# EasyEDA schematic 1-Schematic_WIFI_WAVER.json
TITLE: Sheet_1; REV: 1.0; Date: 2022-12-29; Sheet: 1/1; Drawn By: maarnotto; Company: Your Company
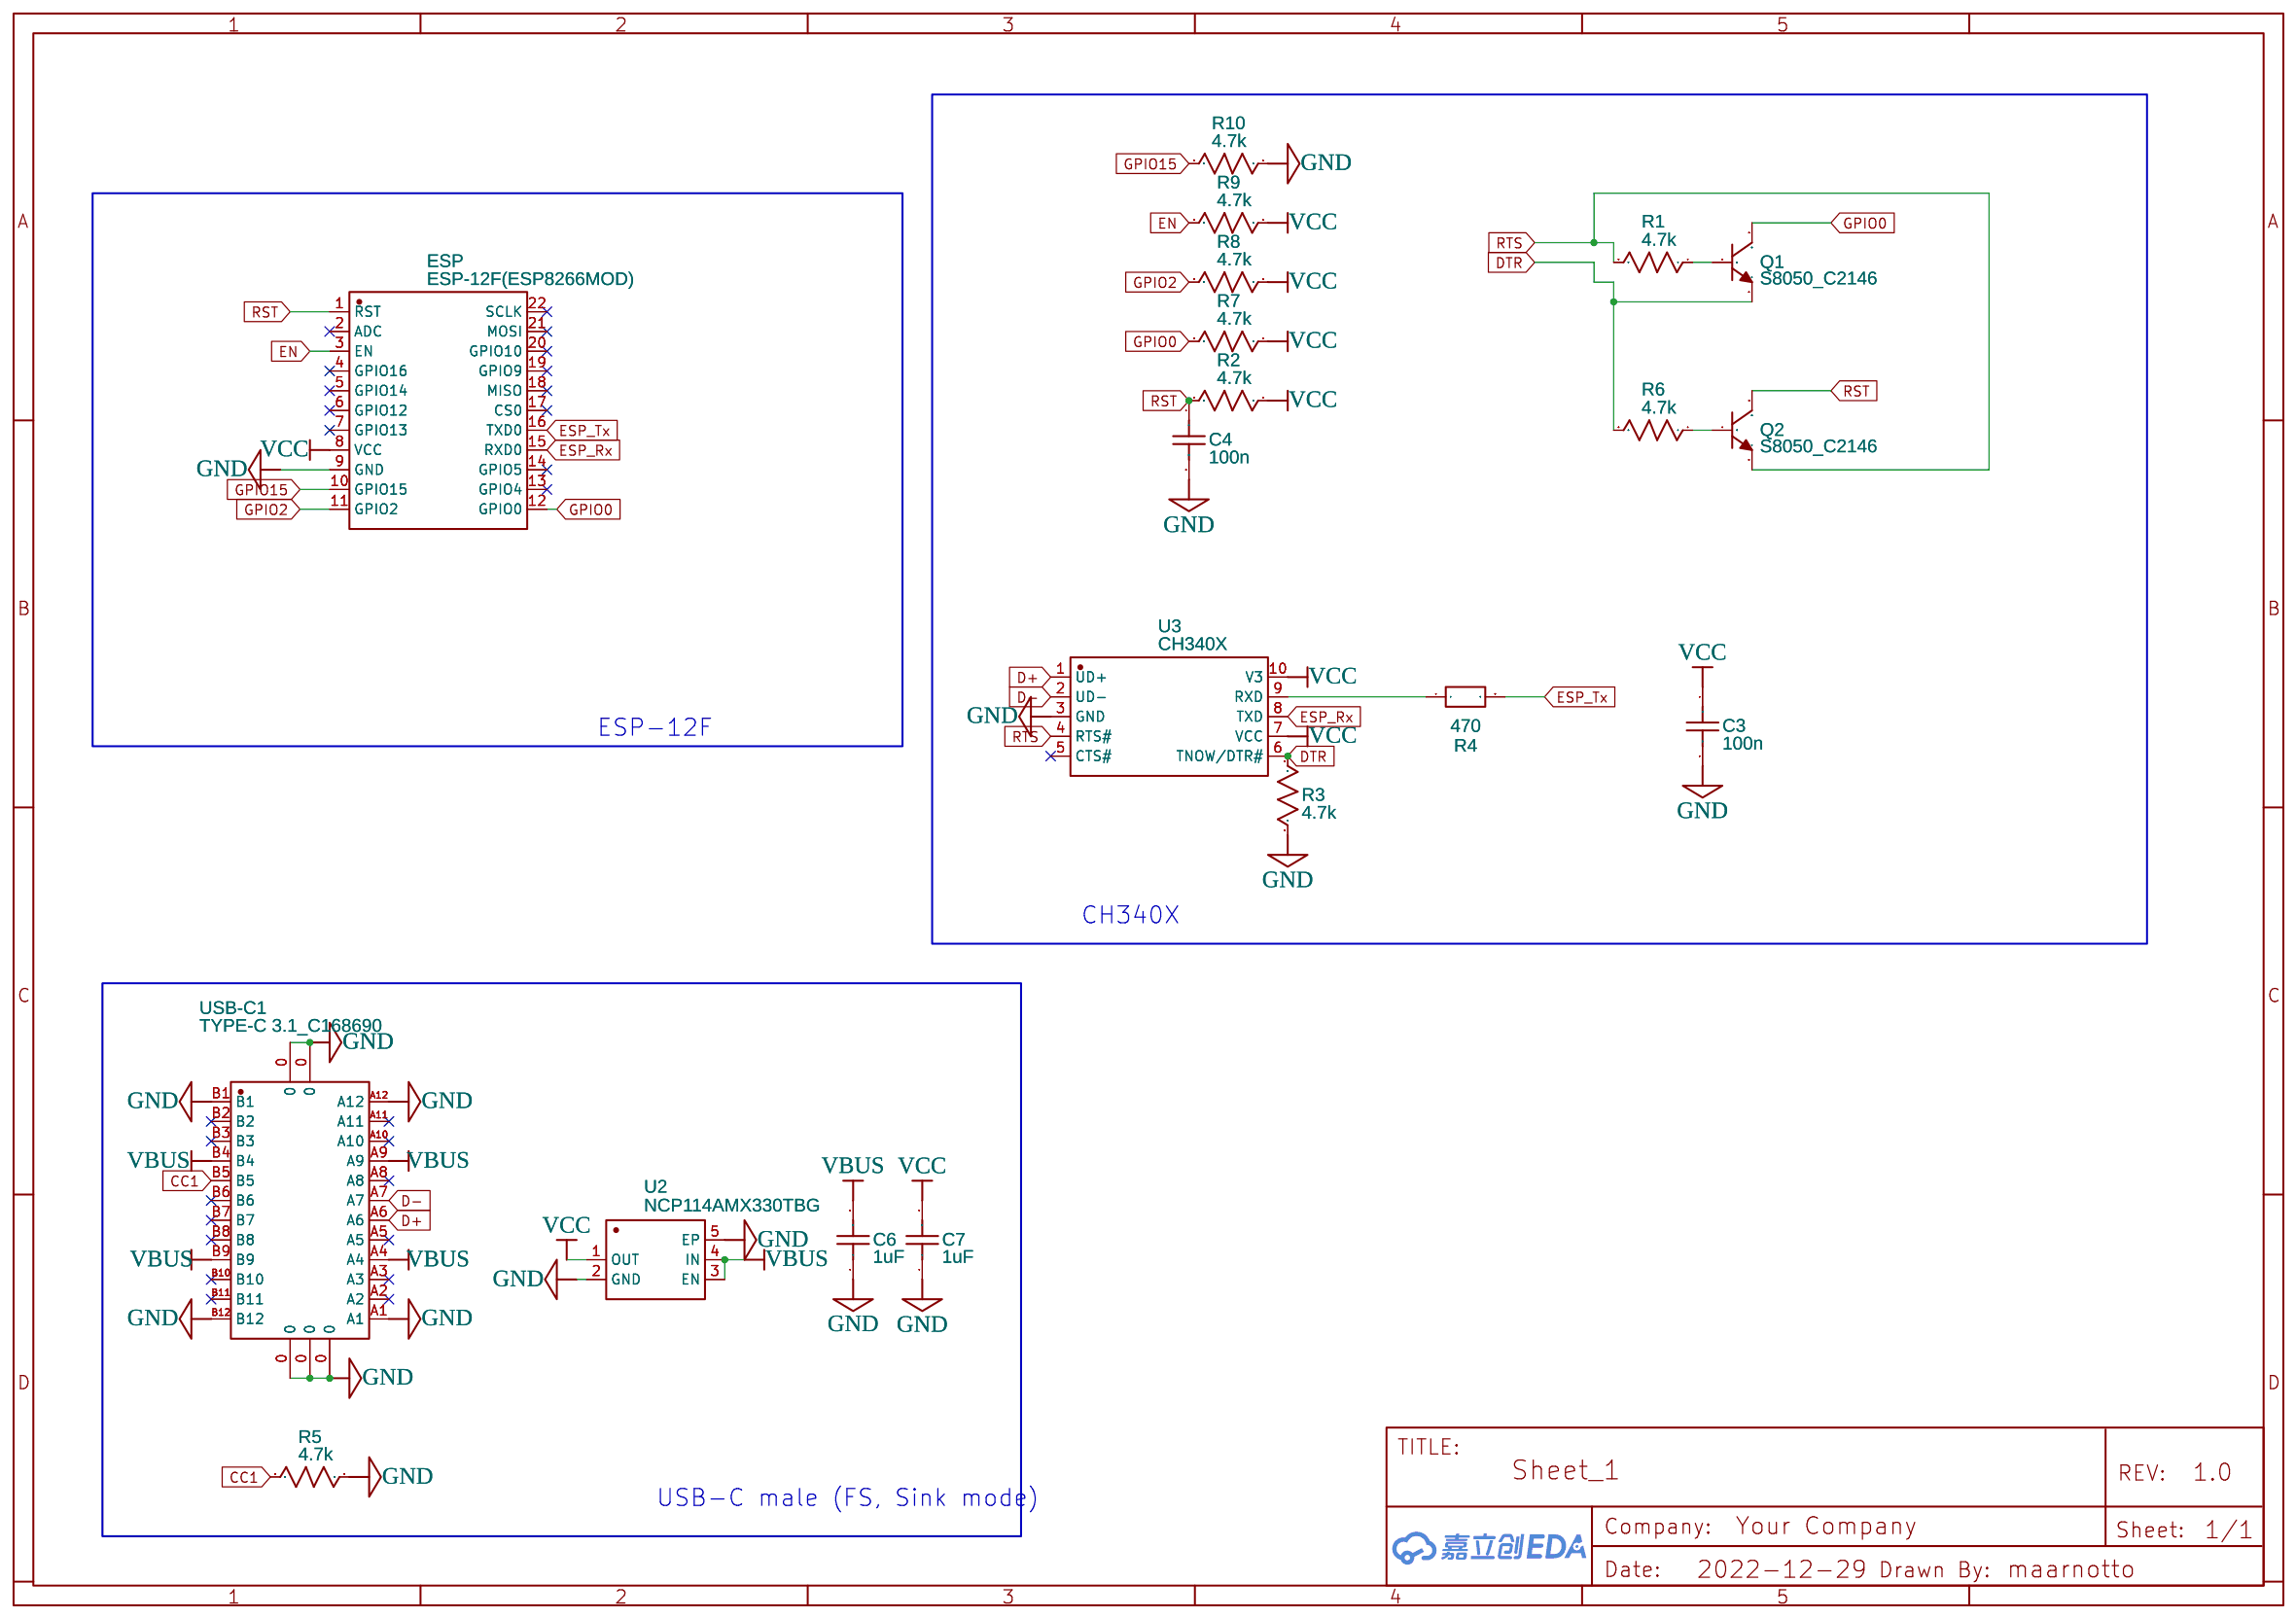
[diagram p0: schematic sheet]

## Parts
C3  100n  [C0402]
C4  100n  [C0402]
C6  1uF  [C0402]
C7  1uF  [C0402]
ESP  ESP-12F(ESP8266MOD)  [WIFIM-SMD_ESP-12F-ESP8266MOD]
Q1  S8050_C2146  [SOT-23-3_L3.0-W1.7-P0.95-LS2.9-BR]
Q2  S8050_C2146  [SOT-23-3_L3.0-W1.7-P0.95-LS2.9-BR]
R1  4.7k  [R0402]
R2  4.7k  [R0402]
R3  4.7k  [R0402]
R4  470  [R0402]
R5  4.7k  [R0402]
R6  4.7k  [R0402]
R7  4.7k  [R0402]
R8  4.7k  [R0402]
R9  4.7k  [R0402]
R10  4.7k  [R0402]
U2  NCP114AMX330TBG  [UDFN-4_L1.0-W1.0-P0.65-BL-EP]
U3  CH340X  [MSOP-10_L3.0-W3.0-P0.50-LS5.0-BL]
USB-C1  TYPE-C 3.1_C168690  [USB-C-SMD_TYPE-C-USB-3]

## Library data of the parts
C3 C4 C6 C7 = C_0603_US: Contributor: LCEDA_Lib
ESP = ESP-12F(ESP8266MOD): Supplier: LCSC; Manufacturer: Ai-Thinker(安信可); Supplier Part: C82891; JLCPCB Part Class: Extended Part
Q1 Q2 = S8050_C2146: Supplier: LCSC; Manufacturer: CJ(江苏长电/长晶); Manufacturer Part: S8050 J3Y; Supplier Part: C2146; JLCPCB Part Class: Basic Part
R1-R3 R5-R10 = R_0603_US: Contributor: LCEDA_Lib
R4 = R_0603_EU: Contributor: LCEDA_Lib
U2 = NCP114AMX330TBG: Contributor: LCSC; Supplier: LCSC; Supplier Part: C603494; Manufacturer: onsemi(安森美); JLCPCB Part Class: Extended Part
U3 = CH340X: Contributor: lcsc; Supplier: LCSC; Supplier Part: C3035748; Manufacturer: WCH(南京沁恒); JLCPCB Part Class: Extended Part
USB-C1 = TYPE-C 3.1_C168690: Contributor: 立创EDA官方封装库; Supplier: LCSC; Supplier Part: C168690; Manufacturer: 精拓金; Manufacturer Part: 918-118A2021Y40000; JLCPCB Part Class: Extended Part

## Nets
GND: C3.2 C4.2 C6.1 C7.1 ESP.9(GND) R3.1 R5.1 R10.1 U2.2(GND) U2.5(EP) U3.3(GND) USB-C1.0 USB-C1.A1 USB-C1.A12 USB-C1.B1 USB-C1.B12
VBUS: C6.2 U2.3(EN) U2.4(IN) USB-C1.A4 USB-C1.A9 USB-C1.B4 USB-C1.B9
VCC: C3.1 C7.2 ESP.8(VCC) R2.1 R7.1 R8.1 R9.1 U2.1(OUT) U3.7(VCC) U3.10(V3)
CC1: R5.2 USB-C1.B5
D+: U3.1(UD+) USB-C1.A6
D-: U3.2(UD-) USB-C1.A7
DTR: Q1.2(E) R3.2 R6.2 U3.6(TNOW/DTR#)
EN: ESP.3(EN) R9.2
ESP_Rx: ESP.15(RXD0) U3.8(TXD)
ESP_Tx: ESP.16(TXD0) R4.2
GPIO0: ESP.12(GPIO0) Q1.3(C) R7.2
GPIO2: ESP.11(GPIO2) R8.2
GPIO15: ESP.10(GPIO15) R10.2
RST: C4.1 ESP.1(RST) Q2.3(C) R2.2
RTS: Q2.2(E) R1.2 U3.4(RTS#)
Net-(Q1-1): Q1.1(B) R1.1
Net-(Q2-1): Q2.1(B) R6.1
Net-(R4-1): R4.1 U3.9(RXD)

Not connected (* = marked no-connect by the designer): ESP 2(ADC)* 4(GPIO16)* 5(GPIO14)* 6(GPIO12)* 7(GPIO13)* 13(GPIO4)* 14(GPIO5)* 17(CS0)* 18(MISO)* 19(GPIO9)* 20(GPIO10)* 21(MOSI)* 22(SCLK)*; U3 5(CTS#)*; USB-C1 A2* A3* A5* A8* A10* A11* B2* B3* B6* B7* B8* B10* B11*

## Notes on the sheet
- ESP-12F
- CH340X
- USB-C male (FS, Sink mode)
